# Altium schematic sheet SAMA7G54_MPU.SchDoc
size 420 x 297 mm; SheetNumber: 10; SheetTotal: 34
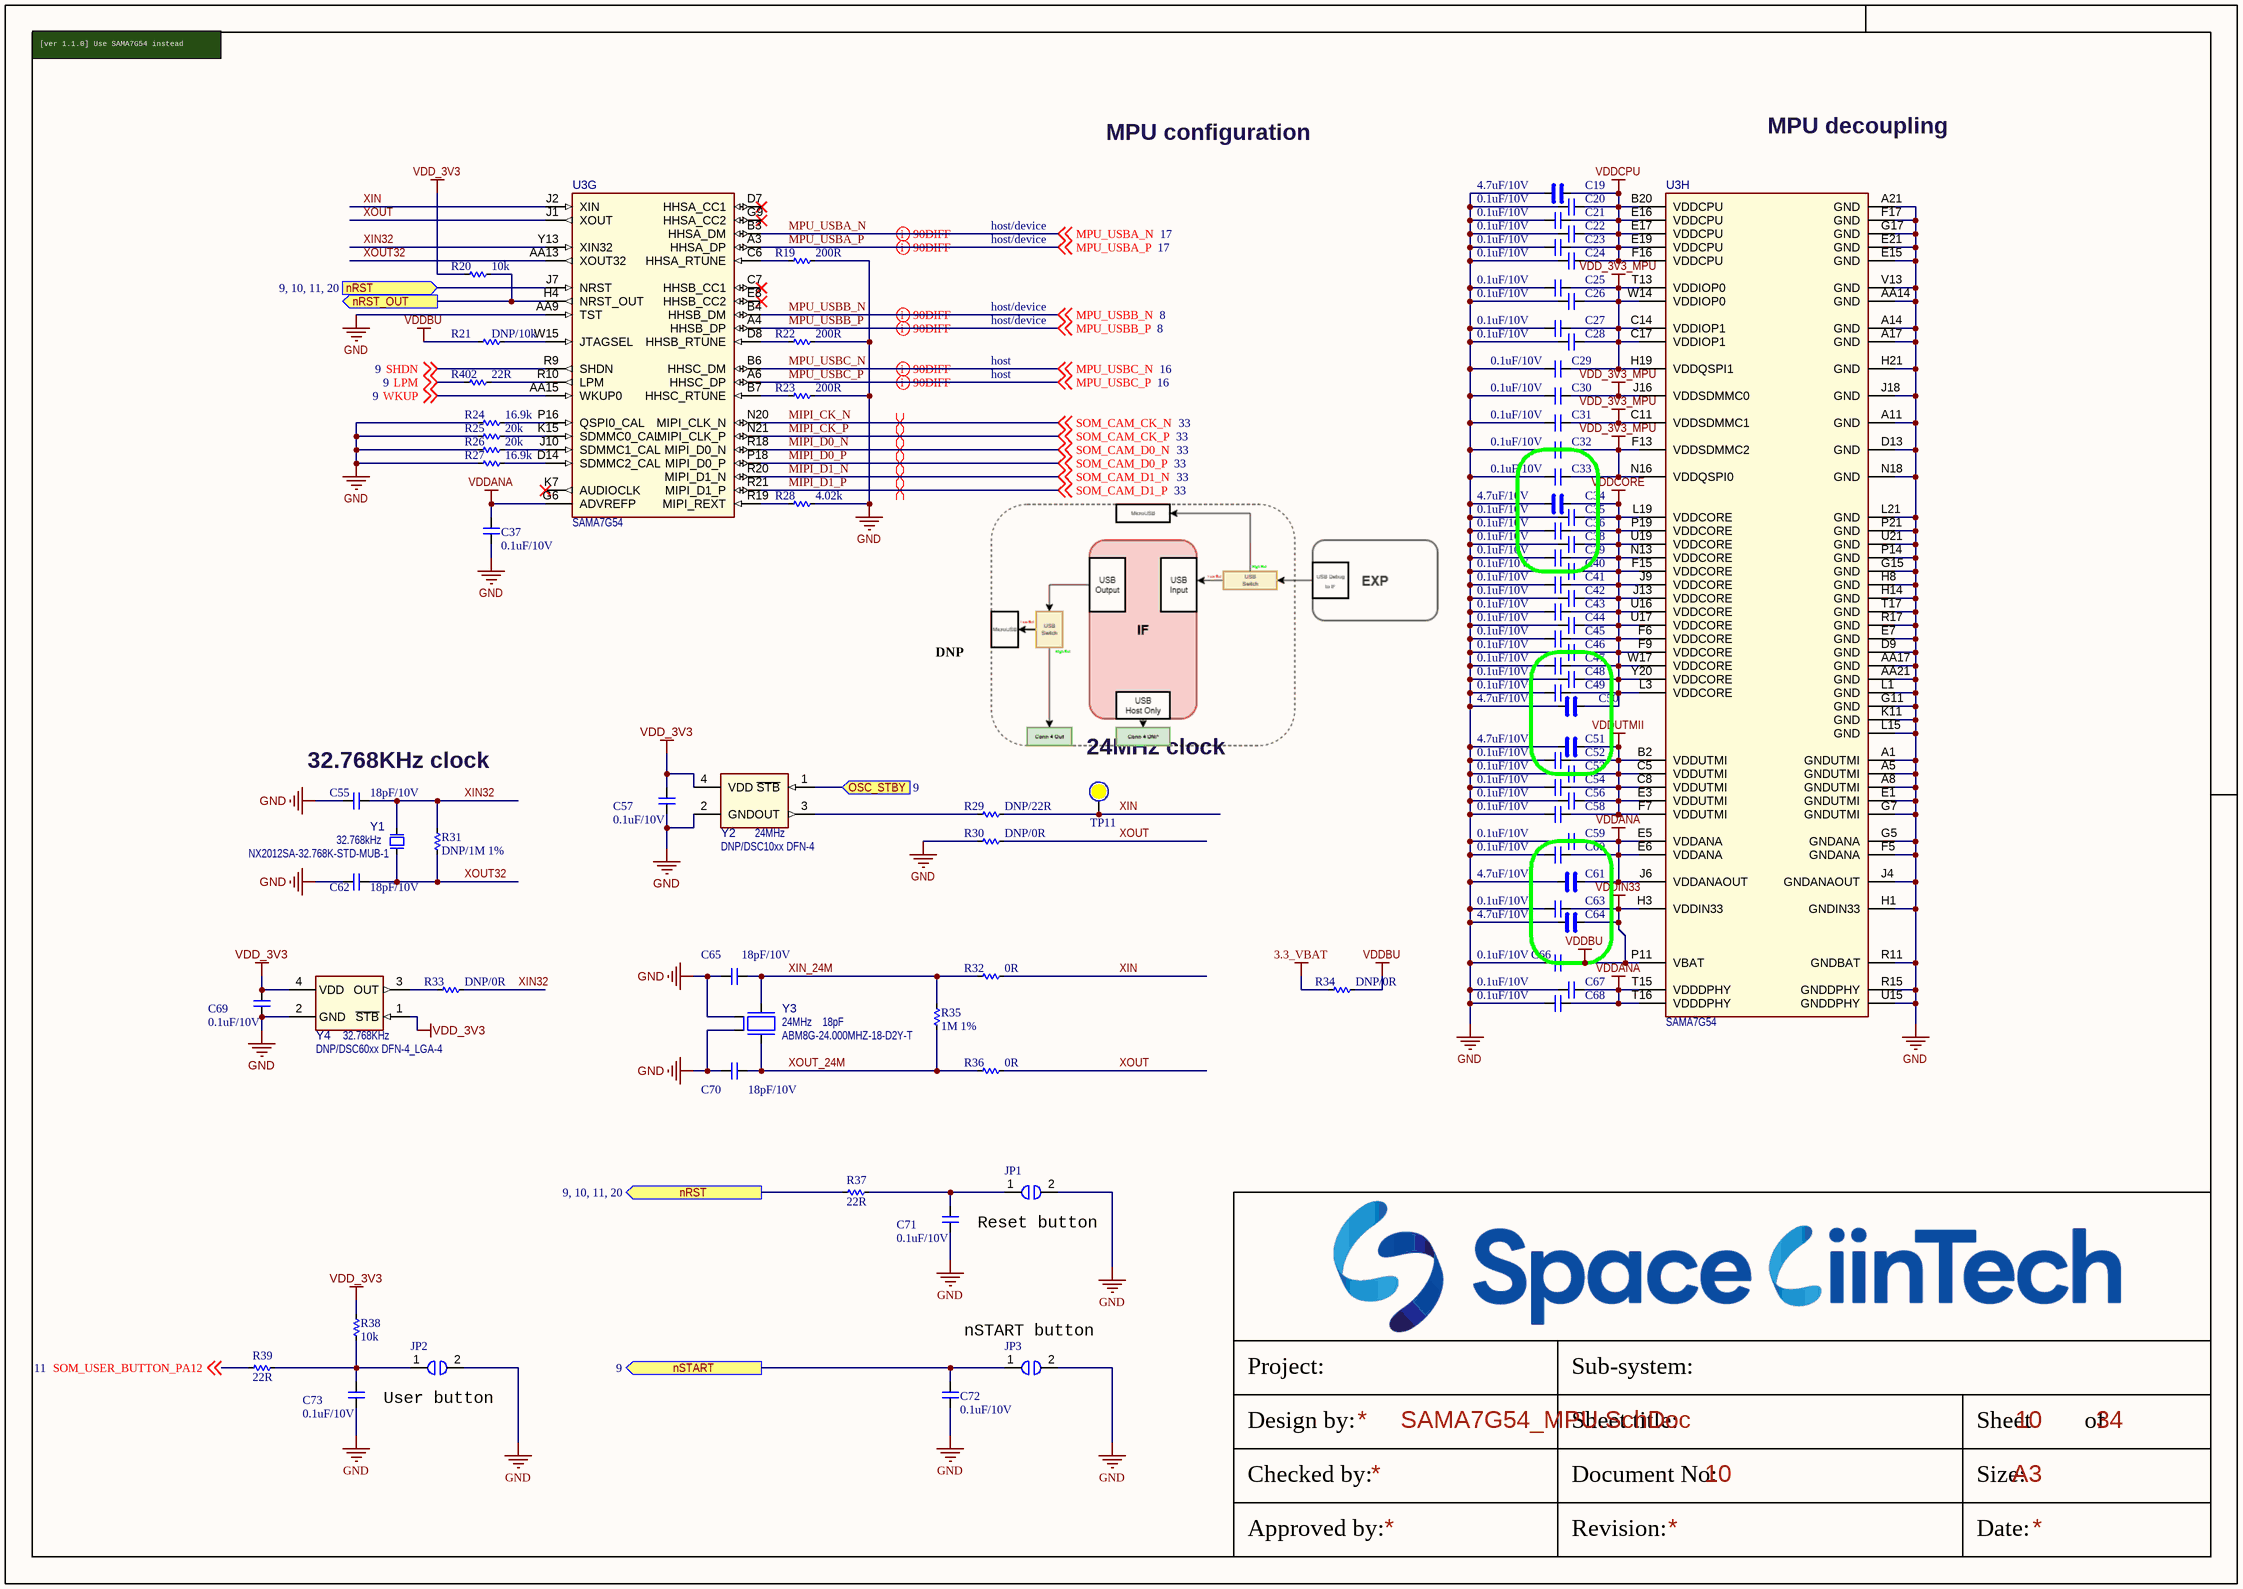
[diagram p0: SAMA7G54_MPU.SchDoc]

## Parts
C19  4.7uF/10V  [CAP_C_1005X50_L]
C20  0.1uF/10V  [CAP_C_0603x30]
C21  0.1uF/10V  [CAP_C_0603x30]
C22  0.1uF/10V  [CAP_C_0603x30]
C23  0.1uF/10V  [CAP_C_0603x30]
C24  0.1uF/10V  [CAP_C_0603x30]
C25  0.1uF/10V  [CAP_C_0603x30]
C26  0.1uF/10V  [CAP_C_0603x30]
C27  0.1uF/10V  [CAP_C_0603x30]
C28  0.1uF/10V  [CAP_C_0603x30]
C29  0.1uF/10V  [CAP_C_0603x30]
C30  0.1uF/10V  [CAP_C_0603x30]
C31  0.1uF/10V  [CAP_C_0603x30]
C32  0.1uF/10V  [CAP_C_0603x30]
C33  0.1uF/10V  [CAP_C_0603x30]
C34  4.7uF/10V  [CAP_C_1005X50_L]
C35  0.1uF/10V  [CAP_C_0603x30]
C36  0.1uF/10V  [CAP_C_0603x30]
C37  0.1uF/10V  [CAP_C_0603x30]
C38  0.1uF/10V  [CAP_C_0603x30]
C39  0.1uF/10V  [CAP_C_0603x30]
C40  0.1uF/10V  [CAP_C_0603x30]
C41  0.1uF/10V  [CAP_C_0603x30]
C42  0.1uF/10V  [CAP_C_0603x30]
C43  0.1uF/10V  [CAP_C_0603x30]
C44  0.1uF/10V  [CAP_C_0603x30]
C45  0.1uF/10V  [CAP_C_0603x30]
C46  0.1uF/10V  [CAP_C_0603x30]
C47  0.1uF/10V  [CAP_C_0603x30]
C48  0.1uF/10V  [CAP_C_0603x30]
C49  0.1uF/10V  [CAP_C_0603x30]
C50  4.7uF/10V  [CAP_C_1005X50_L]
C51  4.7uF/10V  [CAP_C_1005X50_L]
C52  0.1uF/10V  [CAP_C_0603x30]
C53  0.1uF/10V  [CAP_C_0603x30]
C54  0.1uF/10V  [CAP_C_0603x30]
C55  18pF/10V  [CAP_C_1005X50_L]
C56  0.1uF/10V  [CAP_C_0603x30]
C57  0.1uF/10V  [CAP_C_1005X50_L]
C58  0.1uF/10V  [CAP_C_0603x30]
C59  0.1uF/10V  [CAP_C_0603x30]
C60  0.1uF/10V  [CAP_C_0603x30]
C61  4.7uF/10V  [CAP_C_1005X50_L]
C62  18pF/10V  [CAP_C_1005X50_L]
C63  0.1uF/10V  [CAP_C_0603x30]
C64  4.7uF/10V  [CAP_C_1005X50_L]
C65  18pF/10V  [CAP_C_1005X50_L]
C66  0.1uF/10V  [CAP_C_0603x30]
C67  0.1uF/10V  [CAP_C_0603x30]
C68  0.1uF/10V  [CAP_C_0603x30]
C69  0.1uF/10V  [CAP_C_1005X50_L]
C70  18pF/10V  [CAP_C_1005X50_L]
C71  0.1uF/10V  [CAP_C_1005X50_L]
C72  0.1uF/10V  [CAP_C_1005X50_L]
C73  0.1uF/10V  [CAP_C_1005X50_L]
JP1  (no value)  [JUMPER_1608]
JP2  (no value)  [JUMPER_1608]
JP3  (no value)  [JUMPER_1608]
R19  200R  [RES_C_0603X30]
R20  10k  [RES_C_1005x30_L]
R21  DNP/10k  [RES_C_1005x30_L]
R22  200R  [RES_C_0603X30]
R23  200R  [RES_C_0603X30]
R24  16.9k  [RES_C_0603X30]
R25  20k  [RES_C_1005x30_L]
R26  20k  [RES_C_1005x30_L]
R27  16.9k  [RES_C_0603X30]
R28  4.02k  [RES_C_1005x30_L]
R29  DNP/22R  [RES_C_1005x30_L]
R30  DNP/0R  [RES_C_1005x30_L]
R31  DNP/1M 1%  [RES_C_1005x30_L]
R32  0R  [RES_C_1005x30_L]
R33  DNP/0R  [RES_C_1005x30_L]
R34  DNP/0R  [RES_C_1005x30_L]
R35  1M 1%  [RES_C_1005x30_L]
R36  0R  [RES_C_1005x30_L]
R37  22R  [RES_C_1005x30_L]
R38  10k  [RES_C_1005x30_L]
R39  22R  [RES_C_1005x30_L]
R402  22R  [RES_C_1005x30_L]
TP11  (no value)  [Testpoint_80_pin0]  (no BOM)
U3  SAMA7G54  [TFBGA-343_14x14 - 2.5mm]  (parts G,H of 8)
Y1  value 32.768kHz  Manufacturer Part Number 1: NX2012SA-32.768K-STD-MUB-1  [CRYSTAL_NX2012SA]  (hidden comment: Crystal 2 Pins)
Y2  DNP/DSC10xx DFN-4  value 24MHz  [DFN-4_2.5x2]
Y3  value 24MHz  Load Capacitance: 18pF  Manufacturer Part Number 1: ABM8G-24.000MHZ-18-D2Y-T  [CRYSTAL_ABM8G]  (hidden comment: Crystal 4 Pins)
Y4  DNP/DSC60xx DFN-4_LGA-4  value 32.768KHz  [DFN-4_2x1.6]

## Ports
nRST (in, see 9, 10, 11, 20), nRST (out, see 9, 10, 11, 20), nRST_OUT (out), nSTART (out, see 9), OSC_STBY (in, see 9)

## Nets
3.3_VBAT: R34.1
GND: C19.2 C20.2 C21.2 C22.2 C23.2 C24.2 C25.2 C26.2 C27.2 C28.2 C29.2 C30.2 C31.2 C32.2 C33.2 C34.2 C35.2 C36.2 C37.1 C38.2 C39.2 C40.2 C41.2 C42.2 C43.2 C44.2 C45.2 C46.2 C47.2 C48.2 C49.2 C50.2 C51.2 C52.2 C53.2 C54.2 C55.2 C56.2 C57.1 C58.2 C59.2 C60.2 C61.2 C62.2 C63.2 C64.2 C65.2 C66.2 C67.2 C68.2 C69.1 C70.2 C71.1 C72.2 C73.1 JP1.2 JP2.2 JP3.2 R19.1 R22.1 R23.1 R24.2 R25.2 R26.2 R27.2 R28.1 R30.1 U3.A1(GNDUTMI) U3.A5(GNDUTMI) U3.A8(GNDUTMI) U3.A11(GND) U3.A14(GND) U3.A17(GND) U3.A21(GND) U3.AA9(TST) U3.AA14(GND) U3.AA17(GND) U3.AA21(GND) U3.D9(GND) U3.D13(GND) U3.E1(GNDUTMI) U3.E7(GND) U3.E15(GND) U3.E21(GND) U3.F5(GNDANA) U3.F17(GND) U3.G5(GNDANA) U3.G7(GNDUTMI) U3.G11(GND) U3.G15(GND) U3.G17(GND) U3.H1(GNDIN33) U3.H8(GND) U3.H14(GND) U3.H21(GND) U3.J4(GNDANAOUT) U3.J18(GND) U3.K11(GND) U3.L1(GND) U3.L15(GND) U3.L21(GND) U3.N18(GND) U3.P14(GND) U3.P21(GND) U3.R11(GNDBAT) U3.R15(GNDDPHY) U3.R17(GND) U3.T17(GND) U3.U15(GNDDPHY) U3.U21(GND) U3.V13(GND) Y2.2(GND) Y3.2(GND) Y3.4(GND) Y4.2(GND)
VDD_3V3: C57.2 C69.2 R20.2 R38.2 Y2.4(VDD) Y4.1(~{STB}) Y4.4(VDD)
VDD_3V3_MPU: C25.1 C26.1 C27.1 C28.1 C29.1 C30.1 C31.1 C32.1 C33.1 U3.C11(VDDSDMMC1) U3.C14(VDDIOP1) U3.C17(VDDIOP1) U3.F13(VDDSDMMC2) U3.H19(VDDQSPI1) U3.J16(VDDSDMMC0) U3.N16(VDDQSPI0) U3.T13(VDDIOP0) U3.W14(VDDIOP0)
VDDANA: C37.2 C59.1 C60.1 C61.1 C67.1 C68.1 U3.E5(VDDANA) U3.E6(VDDANA) U3.G6(ADVREFP) U3.J6(VDDANAOUT) U3.T15(VDDDPHY) U3.T16(VDDDPHY)
VDDBU: C63.1 C64.1 C66.1 R21.2 R34.2 U3.H3(VDDIN33) U3.P11(VBAT)  [also labelled VDDIN33]
VDDCORE: C34.1 C35.1 C36.1 C38.1 C39.1 C40.1 C41.1 C42.1 C43.1 C44.1 C45.1 C46.1 C47.1 C48.1 C49.1 C50.1 U3.F6(VDDCORE) U3.F9(VDDCORE) U3.F15(VDDCORE) U3.J9(VDDCORE) U3.J13(VDDCORE) U3.L3(VDDCORE) U3.L19(VDDCORE) U3.N13(VDDCORE) U3.P19(VDDCORE) U3.U16(VDDCORE) U3.U17(VDDCORE) U3.U19(VDDCORE) U3.W17(VDDCORE) U3.Y20(VDDCORE)
VDDCPU: C19.1 C20.1 C21.1 C22.1 C23.1 C24.1 U3.B20(VDDCPU) U3.E16(VDDCPU) U3.E17(VDDCPU) U3.E19(VDDCPU) U3.F16(VDDCPU)
VDDUTMII: C51.1 C52.1 C53.1 C54.1 C56.1 C58.1 U3.B2(VDDUTMI) U3.C5(VDDUTMI) U3.C8(VDDUTMI) U3.E3(VDDUTMI) U3.F7(VDDUTMI)
LPM: R402.1 ; off-sheet LPM
MIPI_CK_N: U3.N20(MIPI_CLK_N) ; off-sheet SOM_CAM_CK_N  [also labelled SOM_CAM_CK_N]
MIPI_CK_P: U3.N21(MIPI_CLK_P) ; off-sheet SOM_CAM_CK_P  [also labelled SOM_CAM_CK_P]
MIPI_D0_N: U3.R18(MIPI_D0_N) ; off-sheet SOM_CAM_D0_N  [also labelled SOM_CAM_D0_N]
MIPI_D0_P: U3.P18(MIPI_D0_P) ; off-sheet SOM_CAM_D0_P  [also labelled SOM_CAM_D0_P]
MIPI_D1_N: U3.R20(MIPI_D1_N) ; off-sheet SOM_CAM_D1_N  [also labelled SOM_CAM_D1_N]
MIPI_D1_P: U3.R21(MIPI_D1_P) ; off-sheet SOM_CAM_D1_P  [also labelled SOM_CAM_D1_P]
MPU_USBA_N: U3.B3(HHSA_DM) ; off-sheet MPU_USBA_N
MPU_USBA_P: U3.A3(HHSA_DP) ; off-sheet MPU_USBA_P
MPU_USBB_N: U3.B4(HHSB_DM) ; off-sheet MPU_USBB_N
MPU_USBB_P: U3.A4(HHSB_DP) ; off-sheet MPU_USBB_P
MPU_USBC_N: U3.B6(HHSC_DM) ; off-sheet MPU_USBC_N
MPU_USBC_P: U3.A6(HHSC_DP) ; off-sheet MPU_USBC_P
nRST: R37.1 U3.J7(NRST) ; port nRST
nRST_OUT: R20.1 U3.H4(NRST_OUT) ; port nRST_OUT
nSTART: C72.1 JP3.1 ; port nSTART
OSC_STBY: Y2.1(~{STB}) ; port OSC_STBY
SHDN: U3.R9(SHDN) ; off-sheet SHDN
SOM_USER_BUTTON_PA12: R39.1 ; off-sheet SOM_USER_BUTTON_PA12
WKUP: U3.AA15(WKUP0) ; off-sheet WKUP
XIN: R29.2 R32.2 TP11.0 U3.J2(XIN)
XIN32: C55.1 R31.1 R33.2 U3.Y13(XIN32) Y1.2(Osc2)
XIN_24M: C65.1 R32.1 R35.2 Y3.3(Osc2)
XOUT: R30.2 R36.2 U3.J1(XOUT)
XOUT32: C62.1 R31.2 U3.AA13(XOUT32) Y1.1(Osc1)
XOUT_24M: C70.1 R35.1 R36.1 Y3.1(Osc1)
NetC71_2: C71.2 JP1.1 R37.2
NetC73_2: C73.2 JP2.1 R38.1 R39.2
NetR19_2: R19.2 U3.C6(HHSA_RTUNE)
NetR21_1: R21.1 U3.W15(JTAGSEL)
NetR22_2: R22.2 U3.D8(HHSB_RTUNE)
NetR23_2: R23.2 U3.B7(HHSC_RTUNE)
NetR24_1: R24.1 U3.P16(QSPI0_CAL)
NetR25_1: R25.1 U3.K15(SDMMC0_CAL)
NetR26_1: R26.1 U3.J10(SDMMC1_CAL)
NetR27_1: R27.1 U3.D14(SDMMC2_CAL)
NetR28_2: R28.2 U3.R19(MIPI_REXT)
NetR29_1: R29.1 Y2.3(OUT)
NetR33_1: R33.1 Y4.3(OUT)
NetR402_2: R402.2 U3.R10(LPM)

Not connected (* = marked no-connect by the designer): U3 C7(HHSB_CC1)* D7(HHSA_CC1)* E8(HHSB_CC2)* G9(HHSA_CC2)* K7(AUDIOCLK)*

## Layout directives
differential pair; differential pair class DIFF90; net class DIFF90: MPU_USBA_N, MPU_USBA_P, MPU_USBB_N, MPU_USBB_P, MPU_USBC_N, MPU_USBC_P
differential pair; net class DIFF100; differential pair class DIFF100: MIPI_CK_N, MIPI_CK_P, MIPI_D0_N, MIPI_D0_P, MIPI_D1_N, MIPI_D1_P

## Notes on the sheet
- [ver 1.1.0] Use SAMA7G54 instead
- MPU configuration
- MPU decoupling
- host/device
- host
- DNP
- (near C55) 32.768KHz clock
- (near TP11) 24MHz clock
- Reset button
- (near JP3) nSTART button
- User button
- Project:
- Sub-system:
- Design by:
- Sheet title:
- Sheet
- of
- Checked by:
- Approved by:
- Revision:
- Document No:
- Size:
- Date:
- A3

## Library data of the parts
C19 C34 C50 C51 C61 C64 = _CAP_C_High_2: CAP
C20-C33 C35-C49 C52-C60 C62 C63 C65-C71 C73 = _CAP_C_2: CAP
C72 = _CAP_C_2: CAP CHIP
JP1-JP3 = JUMPER_1_1
R19-R39 R402 = _RES_B_2: RES
TP11 = Test Point: Solder: NF
U3 = SAMA7G54: SAMA7G54 MPU 1000MHz Cortex-A7 TFBGA-343; Manufacturer Part Number 1: SAMA7G54-V/4HB; Manufacturer 1: Microchip; Description_: MCHP MPU 32-BIT Cortex-A7 1000MHz 128kB SAMA7G54-V/4HB TFBGA-343; Populated: YES; MCHP-ID: MIC8923; Symbol: SAMA7G54 TFBGA-343; Dev Tools Status: Design; Owner: Ciprian Abramov; Package: TFBGA-343; Value: SAMA7G54; Type: 32-Bit MPU; Status: MCL Design; Revision: 1; Category: MCHP-Microcontroller; ComponentLink1Description: SVN Datasheet; ComponentLink2Description: Local Datasheet; ComponentLink3URL: C:\ALTIUM_WORK\00001_MCHP-CDB\Library\LibraryRefs\SAMA7G54 TFBGA-343.SchLib; ComponentLink3Description: Open Symbol; ComponentLink4URL: C:\ALTIUM_WORK\00001_MCHP-CDB\Library\Footprints\TFBGA-343_14x14.PcbLib; ComponentLink4Description: Open Footprint; ComponentLink5Description: Open Footprint 2; ComponentLink6Description: Open Footprint 3; ComponentLink7Description: Open Footprint 4; Supplier 1: Microchip; Supplier Part Number 1: SAMA7G54-V/4HB; Quantity Override: 1
Y1 = OSC_32.768kHz: Crystal; Manufacturer 1: NDK; MCHP-ID: OSC1092; Description_: CRYSTAL 32.768kHz 12.5pF SMD NX2012SA; Dev Tools Status: Production; Owner: Jamus Griego; Tolerance: ±20ppm; Load Capacitance: 12.5pF; Populated: YES; Revision: 1; Symbol: Crystal 2 Pins; Status: MCL Design; ComponentLink1URL: https://chn-vm-apps.microchip.com/mchprepo/parts/Datasheets/c_NX2012SA-STD-MUB-1_e.pdf; ComponentLink1Description: SVN Datasheet; ComponentLink2URL: C:\ALTIUM_WORK\00001_MCHP-CDB\Datasheets\c_NX2012SA-STD-MUB-1_e.pdf; ComponentLink2Description: Local Datasheet; ComponentLink3URL: C:\ALTIUM_WORK\00001_MCHP-CDB\Library\LibraryRefs\Crystal 2 Pins.SchLib; ComponentLink3Description: Open Symbol; ComponentLink4URL: C:\ALTIUM_WORK\00001_MCHP-CDB\Library\Footprints\CRYSTAL_NX2012SA.PcbLib; ComponentLink4Description: Open Footprint; ComponentLink5Description: Open Footprint 2; ComponentLink6Description: Open Footprint 3; ComponentLink7Description: Open Footprint 4; Type: Crystal; Category: Crystal/Oscillator; Supplier 1: Digi-Key; Supplier Part Number 1: 644-1219-1-ND; Quantity Override: 1
Y2 = MIC6659: Manufacturer 1: Microchip Technology; Manufacturer Part Number 1: DSC1001DI5-024.0000T; Description_: MCHP CLOCK OSCILLATOR SINGLE 24MHz DSC1001DI5-024.0000 SMD-2520; Dev Tools Status: Design; Owner: Maurizio Gavardoni; Populated: YES; MCHP-ID: MIC6659; Revision: A; Symbol: DSC10xx DFN-4; Status: MCL Design; ComponentLink1Description: SVN Datasheet; ComponentLink2Description: Local Datasheet; ComponentLink3URL: C:\ALTIUM_WORK\00001_MCHP-CDB\Library\LibraryRefs\DSC10xx DFN-4.SchLib; ComponentLink3Description: Open Symbol; ComponentLink4URL: C:\ALTIUM_WORK\00001_MCHP-CDB\Library\Footprints\DFN-4_2.5x2.PcbLib; ComponentLink4Description: Open Footprint; ComponentLink5Description: Open Footprint 2; ComponentLink6Description: Open Footprint 3; ComponentLink7Description: Open Footprint 4; Category: MCHP-Clock/Timing; Type: Oscillator; Supplier 1: Digi-Key; Supplier Part Number 1: DSC1001DI5-024.0000T-ND; Quantity Override: 1
Y3 = OSC_24MHz: Crystal; Manufacturer 1: Abracon Corporation; MCHP-ID: OSC1047; Description_: CRYSTAL 24MHz 18pF SMD ABM8G; Dev Tools Status: Production; Owner: Mark Loper; Populated: DNP; Revision: 1; Symbol: Crystal 4 Pins; Status: MCL Design; ComponentLink1URL: https://chn-vm-apps.microchip.com/mchprepo/parts/Datasheets/ABM8G.pdf; ComponentLink1Description: SVN Datasheet; ComponentLink2URL: C:\ALTIUM_WORK\00001_MCHP-CDB\Datasheets\ABM8G.pdf; ComponentLink2Description: Local Datasheet; ComponentLink3URL: C:\ALTIUM_WORK\00001_MCHP-CDB\Library\LibraryRefs\Crystal 4 Pins.SchLib; ComponentLink3Description: Open Symbol; ComponentLink4URL: C:\ALTIUM_WORK\00001_MCHP-CDB\Library\Footprints\CRYSTAL_ABM8G.PcbLib; ComponentLink4Description: Open Footprint; ComponentLink5Description: Open Footprint 2; ComponentLink6Description: Open Footprint 3; ComponentLink7Description: Open Footprint 4; Package: ABM8G; Type: Crystal; Category: Crystal/Oscillator; Supplier 1: Digi-Key; Supplier Part Number 1: 535-10273-1-ND; Quantity Override: 1
Y4 = MIC8888: Manufacturer 1: Microchip Technology; Manufacturer Part Number 1: DSC6003MA3B-032K768; Description_: MCHP CLOCK OSCILLATOR SINGLE 32.768KHz DSC6003MA3B-032K768 SMD DFN-4; Dev Tools Status: Design; Owner: Ciprian Abramov; Populated: DNP; MCHP-ID: MIC8888; Revision: 1; Symbol: DSC60xx DFN-4_LGA-4; Status: MCL Design; ComponentLink1Description: SVN Datasheet; ComponentLink2Description: Local Datasheet; ComponentLink3URL: C:\ALTIUM_WORK\00001_MCHP-CDB\Library\LibraryRefs\DSC60xx DFN-4_LGA-4.SchLib; ComponentLink3Description: Open Symbol; ComponentLink4URL: C:\ALTIUM_WORK\00001_MCHP-CDB\Library\Footprints\DFN-4_2x1.6.PcbLib; ComponentLink4Description: Open Footprint; ComponentLink5Description: Open Footprint 2; ComponentLink6Description: Open Footprint 3; ComponentLink7Description: Open Footprint 4; Category: MCHP-Clock/Timing; Type: Oscillator; Supplier 1: Digi-Key; Supplier Part Number 1: DSC6003MA3B-032K768-ND; Quantity Override: 1; Supplier 2: Mouser; Supplier Part Number 2: 579-6003MA3B032K768